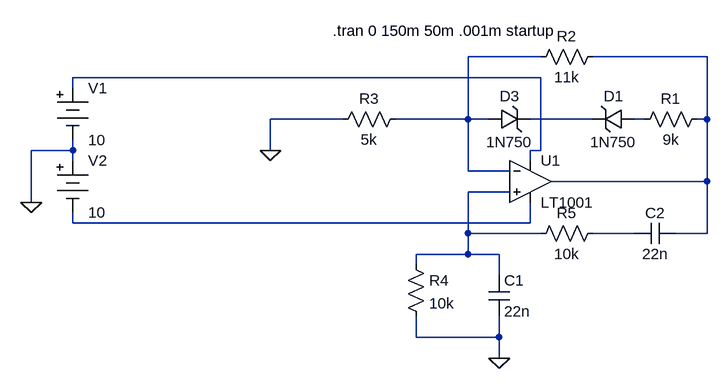
[diagram p0: schematic wien2.asc]
wien2.asc, the LTspice schematic file:
Version 4
SHEET 1 880 680
WIRE 160 -48 48 -48
WIRE 416 -48 240 -48
WIRE 160 -16 -560 -16
WIRE -560 0 -560 -16
WIRE -144 48 -256 48
WIRE 48 48 48 -48
WIRE 48 48 -64 48
WIRE 80 48 48 48
WIRE 240 48 144 48
WIRE 320 48 304 48
WIRE 416 48 416 -48
WIRE 416 48 400 48
WIRE -560 96 -560 80
WIRE -560 96 -624 96
WIRE -256 96 -256 48
WIRE 160 96 160 -16
WIRE 160 96 144 96
WIRE -560 112 -560 96
WIRE 144 112 144 96
WIRE 48 128 48 48
WIRE 112 128 48 128
WIRE 416 144 416 48
WIRE 416 144 176 144
WIRE 112 160 48 160
WIRE -624 176 -624 96
WIRE -560 208 -560 192
WIRE 144 208 144 176
WIRE 144 208 -560 208
WIRE 48 224 48 160
WIRE 160 224 48 224
WIRE 304 224 240 224
WIRE 416 224 416 144
WIRE 416 224 368 224
WIRE 48 256 48 224
WIRE 48 256 -32 256
WIRE 96 256 48 256
WIRE -32 272 -32 256
WIRE 96 288 96 256
WIRE -32 384 -32 352
WIRE 96 384 96 352
WIRE 96 384 -32 384
WIRE 96 416 96 384
FLAG -256 96 0
FLAG 96 416 0
FLAG -624 176 0
SYMBOL Opamps\\LT1001 144 80 R0
SYMATTR InstName U1
SYMBOL res 416 32 R90
WINDOW 0 0 56 VBottom 2
WINDOW 3 32 56 VTop 2
SYMATTR InstName R1
SYMATTR Value 9k
SYMBOL res 256 -64 R90
WINDOW 0 0 56 VBottom 2
WINDOW 3 32 56 VTop 2
SYMATTR InstName R2
SYMATTR Value 11k
SYMBOL res -48 32 R90
WINDOW 0 0 56 VBottom 2
WINDOW 3 32 56 VTop 2
SYMATTR InstName R3
SYMATTR Value 5k
SYMBOL cap 80 288 R0
SYMATTR InstName C1
SYMATTR Value 22n
SYMBOL res 256 208 R90
WINDOW 0 0 56 VBottom 2
WINDOW 3 32 56 VTop 2
SYMATTR InstName R5
SYMATTR Value 10k
SYMBOL cap 368 208 R90
WINDOW 0 0 32 VBottom 2
WINDOW 3 32 32 VTop 2
SYMATTR InstName C2
SYMATTR Value 22n
SYMBOL res -48 256 R0
SYMATTR InstName R4
SYMATTR Value 10k
SYMBOL Misc\\battery -560 -16 R0
WINDOW 123 0 0 Left 2
WINDOW 39 0 0 Left 2
SYMATTR InstName V1
SYMATTR Value 10
SYMBOL Misc\\battery -560 96 R0
WINDOW 123 0 0 Left 2
WINDOW 39 0 0 Left 2
SYMATTR InstName V2
SYMATTR Value 10
SYMBOL zener 80 64 R270
WINDOW 0 36 32 VTop 2
WINDOW 3 -4 32 VBottom 2
SYMATTR InstName D3
SYMATTR Value 1N750
SYMBOL zener 304 32 R90
WINDOW 0 -4 32 VBottom 2
WINDOW 3 36 32 VTop 2
SYMATTR InstName D1
SYMATTR Value 1N750
TEXT -160 -88 Left 2 !.tran 0 150m 50m .001m startup

The netlist it stands for:
* wien2.asc
XU1 N006 N001 N003 N007 N002 LT1001  ; pins In+ In- V+ V- OUT
R1 N002 N005 9k
R2 N002 N001 11k
R3 N001 0 5k
C1 N006 0 22n
R5 N008 N006 10k
C2 N002 N008 22n
R4 N006 0 10k
V1 N003 0 10
V2 0 N007 10
D3 N001 N004 1N750
D1 N005 N004 1N750
.model D D
.lib standard.dio
.tran 0 150m 50m .001m startup
.lib LTC.lib
.backanno
.end